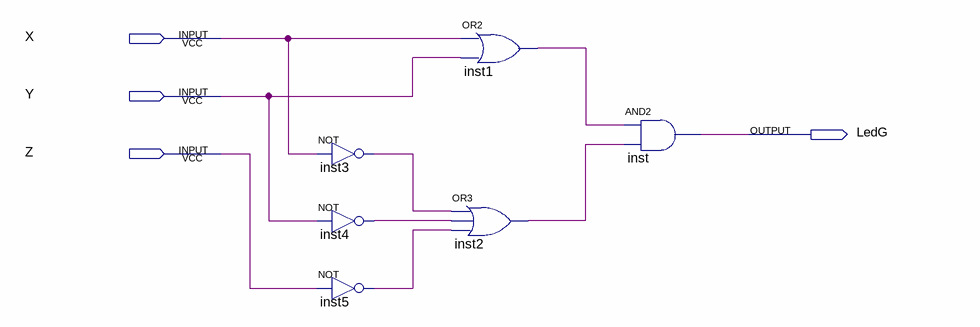
[diagram p0: schematic sheet]
// Quartus schematic LEDg.bdf as structural Verilog: 6 symbols, 4 pins
module LEDg (
  input  X,
  input  Y,
  input  Z,
  output LedG
);

  wire inst1_out, inst2_out, inst3_out, inst4_out, inst5_out;

  not inst3 (inst3_out, X);
  not inst4 (inst4_out, Y);
  not inst5 (inst5_out, Z);
  or inst1 (inst1_out, X, Y);
  or inst2 (inst2_out, inst3_out, inst4_out, inst5_out);
  and inst (LedG, inst1_out, inst2_out);
endmodule
